# EAGLE schematic perfect-cell-v0.1 (EAGLE 7.3.0)

## Sheet 1 of 3
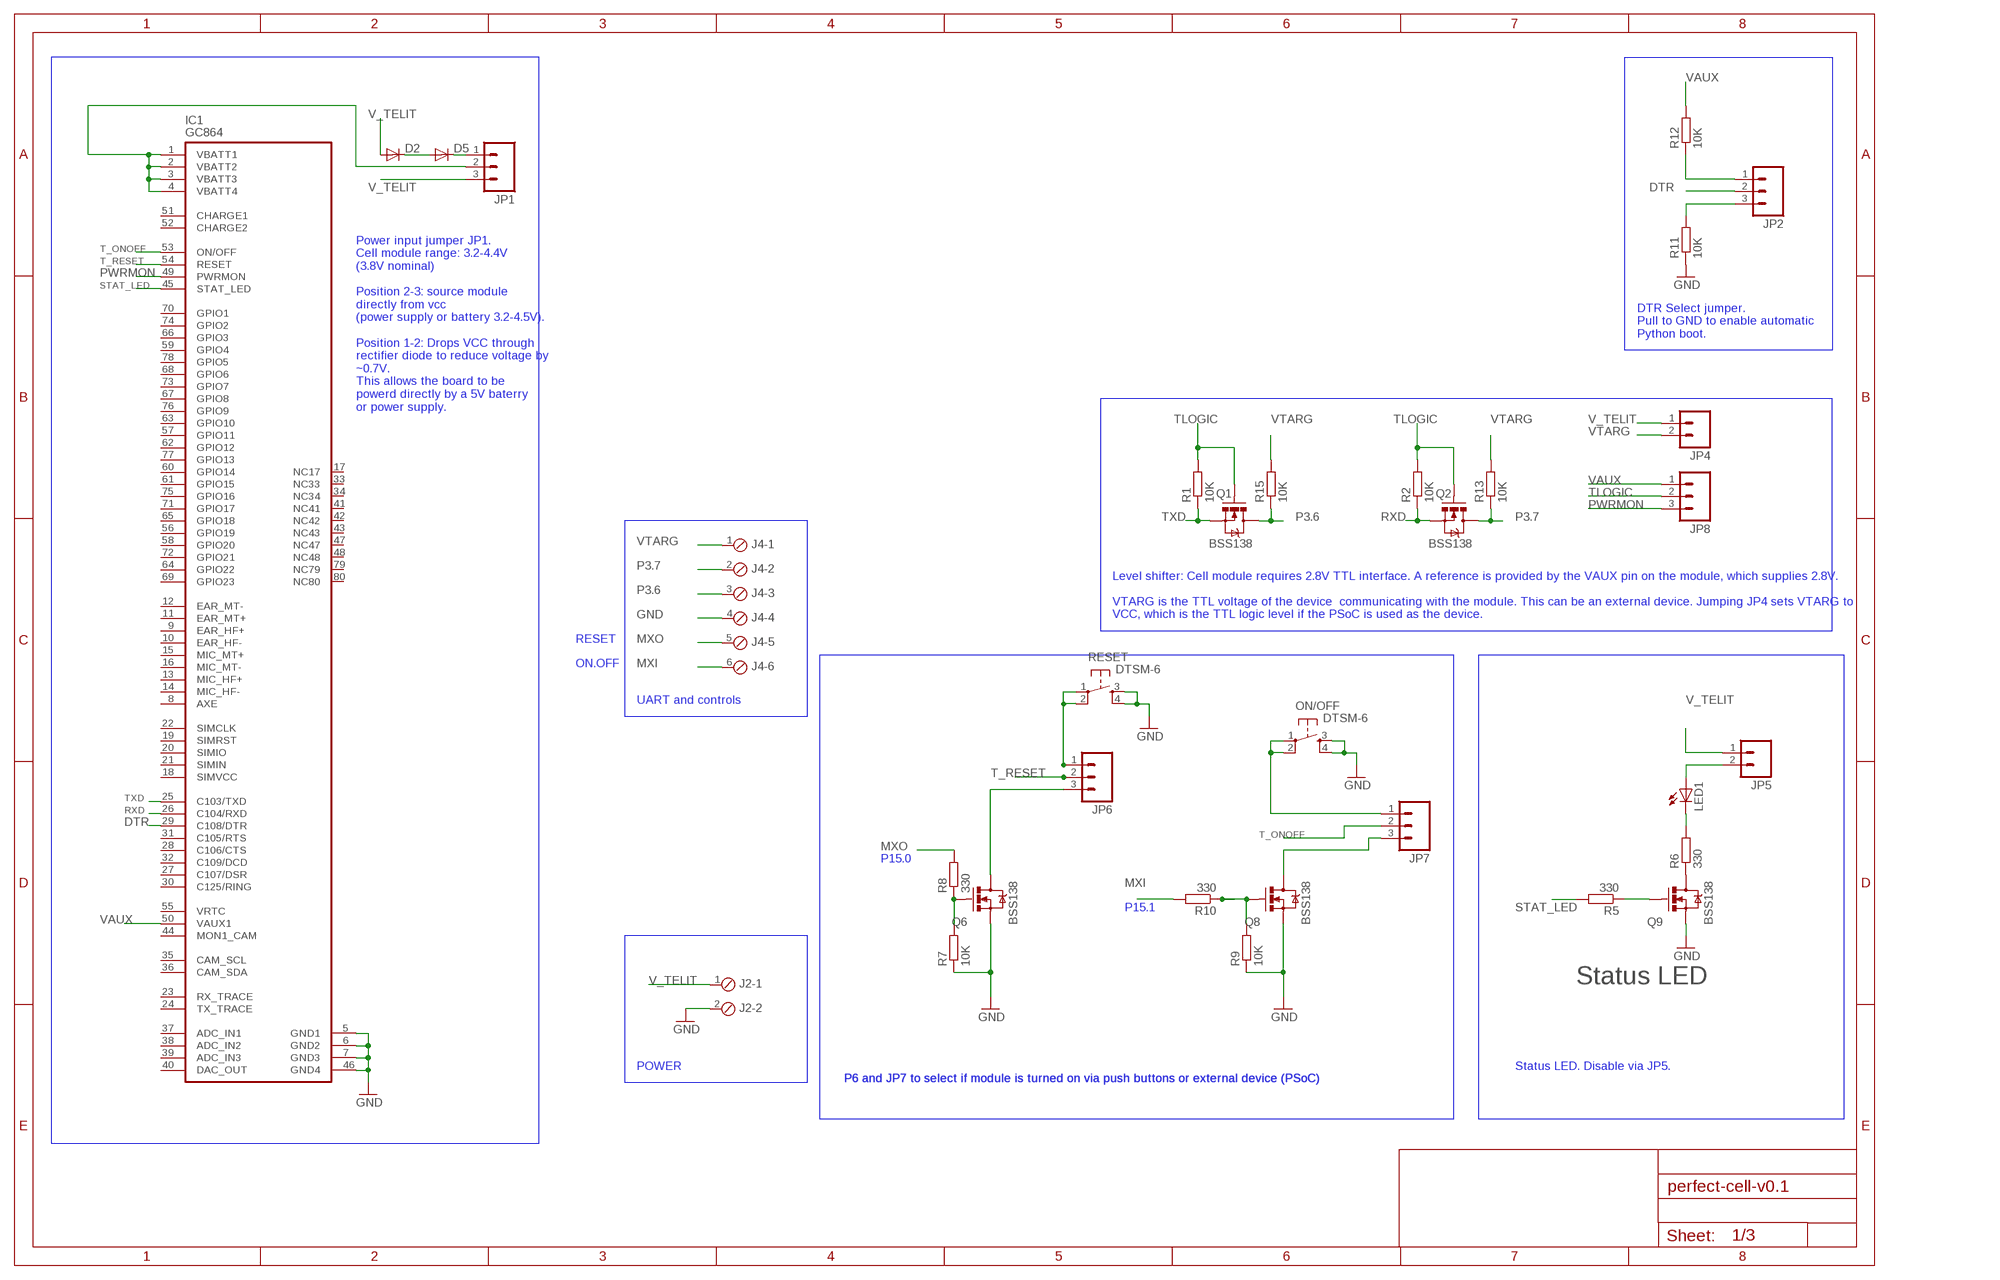
[diagram p0: schematic, sheet 1]

### Parts
D2  DIODESMA  [SMA-DIODE]
D5  DIODESMA  [SMA-DIODE]
IC1  GC864  [GC864]
J2  MPT2  [2POL254]
J4  MPT6  [6POL254]
JP1  M03LOCK  [1X03_LOCK]
JP2  M03LOCK  [1X03_LOCK]
JP4  M02LOCK  [1X02_LOCK]
JP5  M02LOCK  [1X02_LOCK]
JP6  M03LOCK  [1X03_LOCK]
JP7  M03LOCK  [1X03_LOCK]
JP8  M03LOCK  [1X03_LOCK]
LED1  LEDSML0805  [SML0805]
ON/OFF  DTSM-6  [DTSM-6]
Q1  BSS138  MOSFET-NCHANNELSMD  [SOT23-3]
Q2  BSS138  MOSFET-NCHANNELSMD  [SOT23-3]
Q6  BSS138  MOSFET-NCHANNELSMD  [SOT23-3]
Q8  BSS138  MOSFET-NCHANNELSMD  [SOT23-3]
Q9  BSS138  MOSFET-NCHANNELSMD  [SOT23-3]
R1  10K  R-EU_R0805  [R0805]
R2  10K  R-EU_R0805  [R0805]
R5  330  R-EU_R0805  [R0805]
R6  330  R-EU_R0805  [R0805]
R7  10K  R-EU_R0805  [R0805]
R8  330  R-EU_R0805  [R0805]
R9  10K  R-EU_R0805  [R0805]
R10  330  R-EU_R0805  [R0805]
R11  10K  R-EU_R0805  [R0805]
R12  10K  R-EU_R0805  [R0805]
R13  10K  R-EU_R0805  [R0805]
R15  10K  R-EU_R0805  [R0805]
RESET  DTSM-6  [DTSM-6]

### Nets
DTR: IC1.29(C108/DTR) JP2.2
GND: IC1.5(GND1) IC1.6(GND2) IC1.7(GND3) IC1.46(GND4) J2.2 J4.4 ON/OFF.3 ON/OFF.4 Q6.2(S) Q8.2(S) Q9.2(S) R7.1 R9.1 R11.1 RESET.3 RESET.4 ; also sheet 2,3
MXI: J4.6 R10.2 ; also sheet 3
MXO: J4.5 R8.2 ; also sheet 3
N$1: Q6.1(G) R7.2 R8.1
N$2: IC1.1(VBATT1) IC1.2(VBATT2) IC1.3(VBATT3) IC1.4(VBATT4) JP1.2
N$3: D2.C D5.A
N$4: Q9.3(D) R6.1
N$7: JP5.2 LED1.A
N$8: LED1.C R6.2
N$9: Q8.1(G) R9.2 R10.1
N$10: Q9.1(G) R5.1
N$11: JP2.1 R12.1
N$13: JP2.3 R11.2
N$14: D5.C JP1.1
N$15: JP7.3 Q8.3(D)
N$17: JP6.3 Q6.3(D)
N$21: JP7.1 ON/OFF.1 ON/OFF.2
N$39: JP6.1 RESET.1 RESET.2
P3.6: J4.3 Q1.3(D) R15.1 ; also sheet 3
P3.7: J4.2 Q2.3(D) R13.1 ; also sheet 3
PWRMON: IC1.49(PWRMON) JP8.3
RXD: IC1.26(C104/RXD) Q2.2(S) R2.1
STAT_LED: IC1.45(STAT_LED) R5.2
T_ONOFF: IC1.53(ON/OFF) JP7.2
T_RESET: IC1.54(RESET) JP6.2
TLOGIC: JP8.2 Q1.1(G) Q2.1(G) R1.2 R2.2
TXD: IC1.25(C103/TXD) Q1.2(S) R1.1
V_TELIT: D2.A J2.1 JP1.3 JP4.1 JP5.1 ; also sheet 2
VAUX: IC1.50(VAUX1) JP8.1 R12.2
VTARG: J4.1 JP4.2 R13.2 R15.2
Unconnected: IC1.8(AXE) IC1.9(EAR_HF+) IC1.10(EAR_HF-) IC1.11(EAR_MT+) IC1.12(EAR_MT-) IC1.13(MIC_HF+) IC1.14(MIC_HF-) IC1.15(MIC_MT+) IC1.16(MIC_MT-) IC1.17(NC17) IC1.18(SIMVCC) IC1.19(SIMRST) IC1.20(SIMIO) IC1.21(SIMIN) IC1.22(SIMCLK) IC1.23(RX_TRACE) IC1.24(TX_TRACE) IC1.27(C107/DSR) IC1.28(C106/CTS) IC1.30(C125/RING) IC1.31(C105/RTS) IC1.32(C109/DCD) IC1.33(NC33) IC1.34(NC34) IC1.35(CAM_SCL) IC1.36(CAM_SDA) IC1.37(ADC_IN1) IC1.38(ADC_IN2) IC1.39(ADC_IN3) IC1.40(DAC_OUT) IC1.41(NC41) IC1.42(NC42) IC1.43(NC43) IC1.44(MON1_CAM) IC1.47(NC47) IC1.48(NC48) IC1.55(VRTC) IC1.56(GPIO19) IC1.57(GPIO11) IC1.58(GPIO20) IC1.59(GPIO4) IC1.60(GPIO14) IC1.61(GPIO15) IC1.62(GPIO12) IC1.63(GPIO10) IC1.64(GPIO22) IC1.65(GPIO18) IC1.66(GPIO3) IC1.67(GPIO8) IC1.68(GPIO6) IC1.69(GPIO23) IC1.70(GPIO1) IC1.71(GPIO17) IC1.72(GPIO21) IC1.73(GPIO7) IC1.74(GPIO2) IC1.75(GPIO16) IC1.76(GPIO9) IC1.77(GPIO13) IC1.78(GPIO5) IC1.79(NC79) IC1.80(NC80)

### Notes on the sheet
- DTR Select jumper.
  Pull to GND to enable automatic 
  Python boot.
- Power input jumper JP1. 
  Cell module range: 3.2-4.4V 
  (3.8V nominal)
  
  Position 2-3: source module
  directly from vcc
  (power supply or battery 3.2-4.5V).
  
  Position 1-2: Drops VCC through 
  rectifier diode to reduce voltage by 
  ~0.7V. 
  This allows the board to be
  powerd directly by a 5V baterry
  or power supply.
- Level shifter: Cell module requires 2.8V TTL interface. A reference is provided by the VAUX pin on the module, which supplies 2.8V.
  
  VTARG is the TTL voltage of the device  communicating with the module. This can be an external device. Jumping JP4 sets VTARG to 
  VCC, which is the TTL logic level if the PSoC is used as the device.
- RESET
- ON.OFF
- UART and controls
- P15.0
- P15.1
- Status LED
- POWER | Status LED. Disable via JP5.
- P6 and JP7 to select if module is turned on via push buttons or external device (PSoC) | P6 and JP7 to select if module is turned on via push buttons or external device (PSoC)

## Sheet 2 of 3
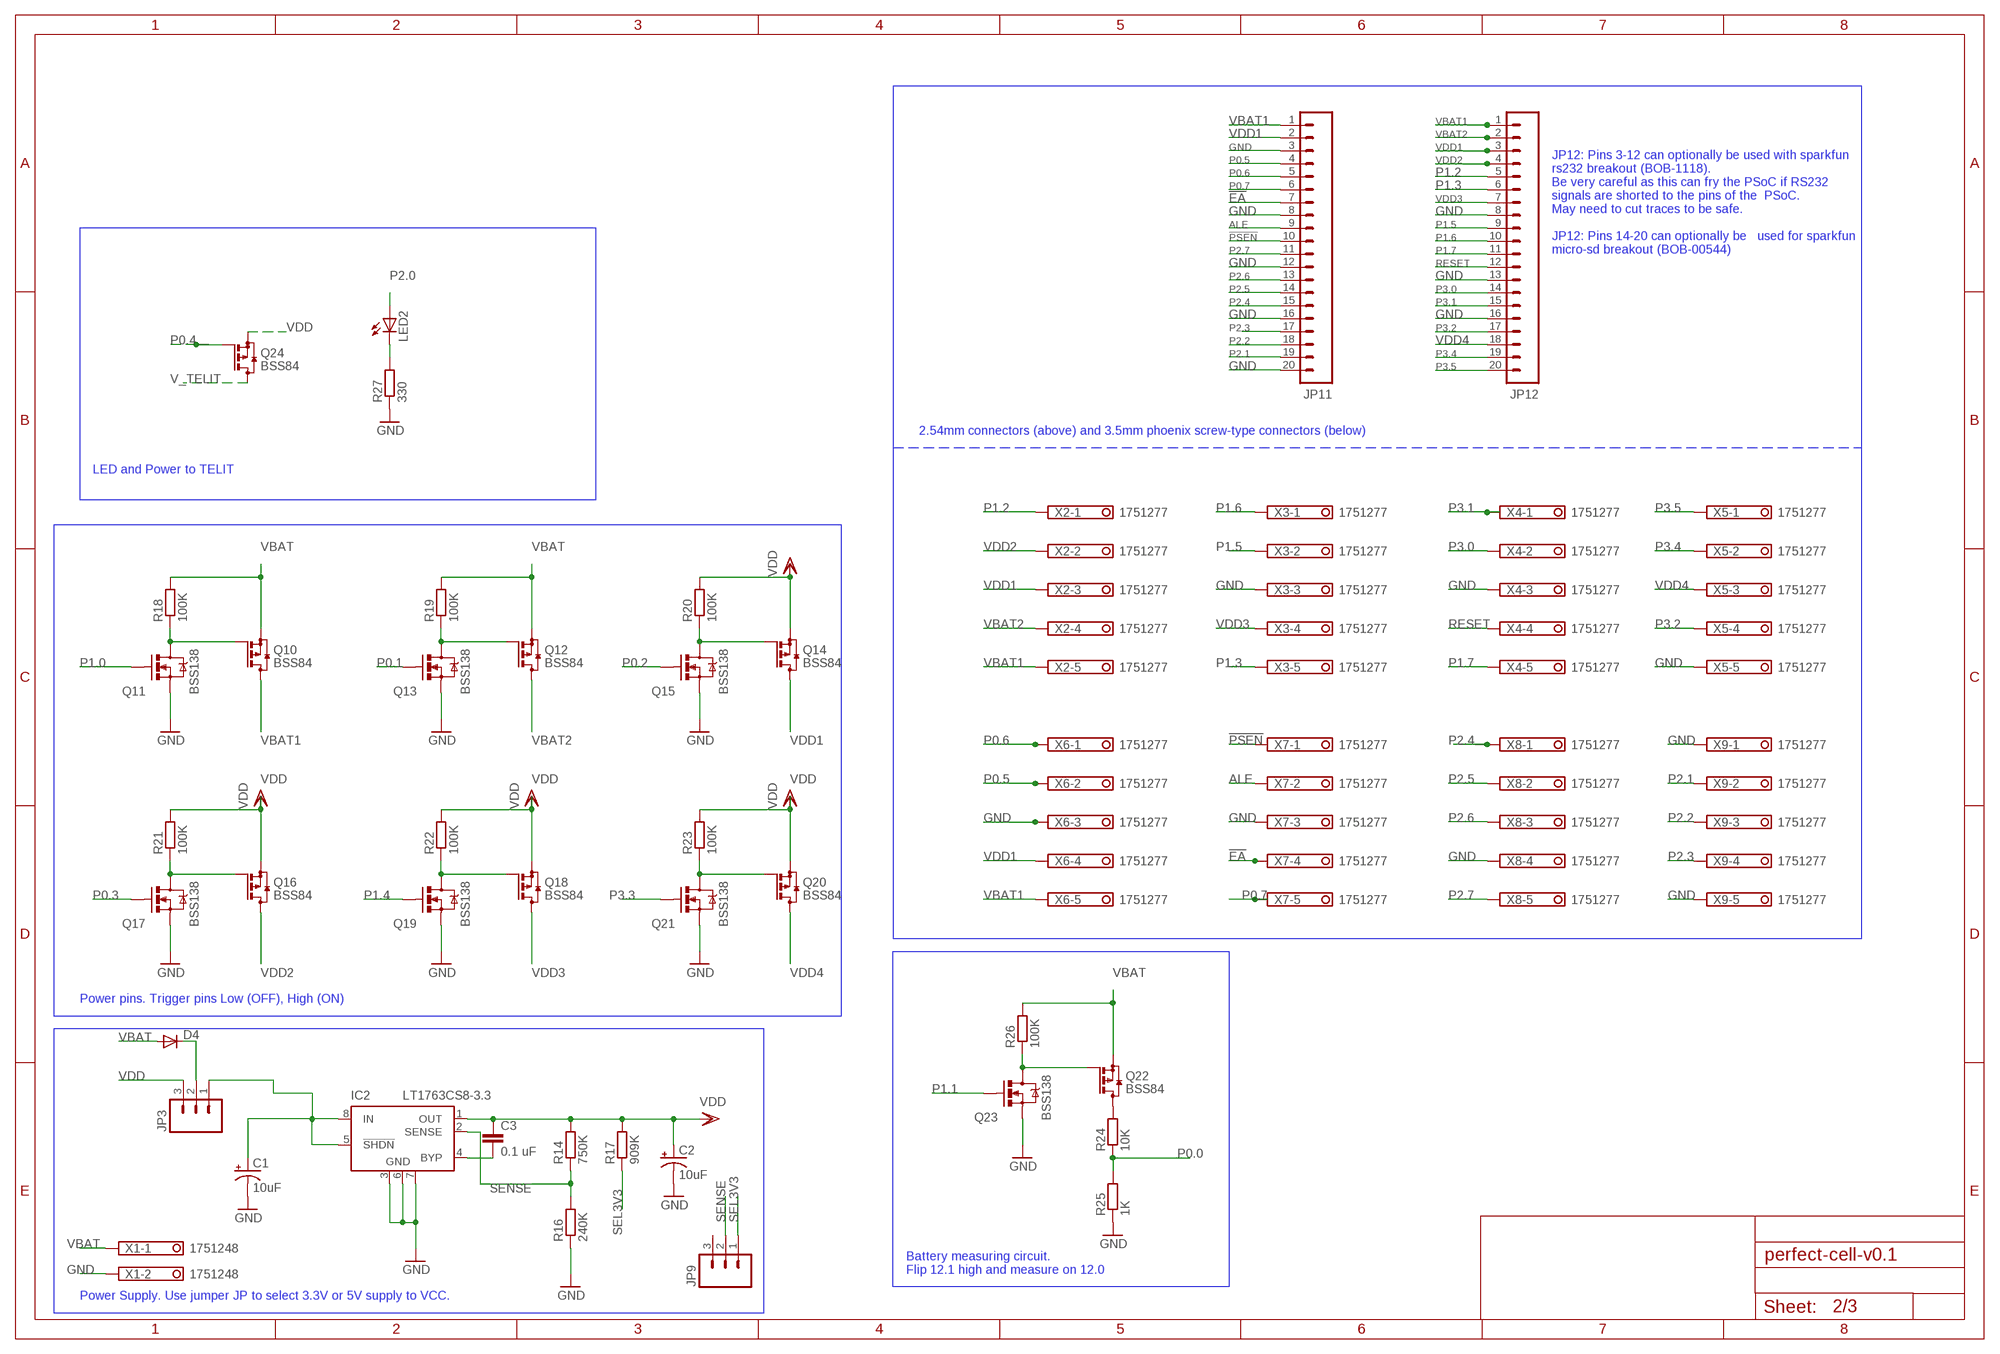
[diagram p1: schematic, sheet 2]

### Parts
C1  10uF  10UF-16V-10%(TANT)  [EIA3216]
C2  10uF  10UF-16V-10%(TANT)  [EIA3216]
C3  0.1 uF  CAP0402-CAP  [0402-CAP]
D4  DIODESMA  [SMA-DIODE]
IC2  LT1763CS8-3.3  [SOIC8]
JP3  M03LOCK  [1X03_LOCK]
JP9  M03LOCK  [1X03_LOCK]
JP11  M20  [1X20]
JP12  M20  [1X20]
LED2  LEDSML0805  [SML0805]
Q10  BSS84  [SOT23]
Q11  BSS138  MOSFET-NCHANNELSMD  [SOT23-3]
Q12  BSS84  [SOT23]
Q13  BSS138  MOSFET-NCHANNELSMD  [SOT23-3]
Q14  BSS84  [SOT23]
Q15  BSS138  MOSFET-NCHANNELSMD  [SOT23-3]
Q16  BSS84  [SOT23]
Q17  BSS138  MOSFET-NCHANNELSMD  [SOT23-3]
Q18  BSS84  [SOT23]
Q19  BSS138  MOSFET-NCHANNELSMD  [SOT23-3]
Q20  BSS84  [SOT23]
Q21  BSS138  MOSFET-NCHANNELSMD  [SOT23-3]
Q22  BSS84  [SOT23]
Q23  BSS138  MOSFET-NCHANNELSMD  [SOT23-3]
Q24  BSS84  [SOT23]
R14  750K  R-EU_R0805  [R0805]
R16  240K  R-EU_R0805  [R0805]
R17  909K  R-EU_R0805  [R0805]
R18  100K  R-EU_R0805  [R0805]
R19  100K  R-EU_R0805  [R0805]
R20  100K  R-EU_R0805  [R0805]
R21  100K  R-EU_R0805  [R0805]
R22  100K  R-EU_R0805  [R0805]
R23  100K  R-EU_R0805  [R0805]
R24  10K  R-EU_R0805  [R0805]
R25  1K  R-EU_R0805  [R0805]
R26  100K  R-EU_R0805  [R0805]
R27  330  R-EU_R0805  [R0805]
X1  1751248  [1751248]
X2  1751277  [1751277]
X3  1751277  [1751277]
X4  1751277  [1751277]
X5  1751277  [1751277]
X6  1751277  [1751277]
X7  1751277  [1751277]
X8  1751277  [1751277]
X9  1751277  [1751277]

### Nets
!EA: JP11.7 X7.4 ; also sheet 3
!PSEN: JP11.10 X7.1 ; also sheet 3
ALE: JP11.9 X7.2 ; also sheet 3
GND: C1.C(-) C2.C(-) IC2.3(GND) IC2.6(GND) IC2.7(GND) JP11.3 JP11.8 JP11.12 JP11.16 JP11.20 JP12.8 JP12.13 JP12.16 Q11.2(S) Q13.2(S) Q15.2(S) Q17.2(S) Q19.2(S) Q21.2(S) Q23.2(S) R16.1 R25.1 R27.1 X1.2 X3.3 X4.3 X5.5 X6.3 X7.3 X8.4 X9.1 X9.5 ; also sheet 1,3
N$5: D4.C JP3.2
N$16: Q10.1(G) Q11.3(D) R18.1
N$18: C1.A(+) IC2.5(!SHDN) IC2.8(IN) JP3.1
N$19: Q12.1(G) Q13.3(D) R19.1
N$20: C3.2 IC2.4(BYP)
N$22: Q14.1(G) Q15.3(D) R20.1
N$23: Q16.1(G) Q17.3(D) R21.1
N$24: Q18.1(G) Q19.3(D) R22.1
N$25: Q20.1(G) Q21.3(D) R23.1
N$26: Q22.1(G) Q23.3(D) R26.1
N$27: Q22.3(D) R24.2
N$29: LED2.C R27.2
P0.0: R24.1 R25.2 ; also sheet 3
P0.1: Q13.1(G) ; also sheet 3
P0.2: Q15.1(G) ; also sheet 3
P0.3: Q17.1(G) ; also sheet 3
P0.4: Q24.1(G) ; also sheet 3
P0.5: JP11.4 X6.2 ; also sheet 3
P0.6: JP11.5 X6.1 ; also sheet 3
P0.7: JP11.6 X7.5 ; also sheet 3
P1.0: Q11.1(G) ; also sheet 3
P1.1: Q23.1(G) ; also sheet 3
P1.2: JP12.5 X2.1 ; also sheet 3
P1.3: JP12.6 X3.5 ; also sheet 3
P1.4: Q19.1(G) ; also sheet 3
P1.5: JP12.9 X3.2 ; also sheet 3
P1.6: JP12.10 X3.1 ; also sheet 3
P1.7: JP12.11 X4.5 ; also sheet 3
P2.0: LED2.A ; also sheet 3
P2.1: JP11.19 X9.2 ; also sheet 3
P2.2: JP11.18 X9.3 ; also sheet 3
P2.3: JP11.17 X9.4 ; also sheet 3
P2.4: JP11.15 X8.1 ; also sheet 3
P2.5: JP11.14 X8.2 ; also sheet 3
P2.6: JP11.13 X8.3 ; also sheet 3
P2.7: JP11.11 X8.5 ; also sheet 3
P3.0: JP12.14 X4.2 ; also sheet 3
P3.1: JP12.15 X4.1 ; also sheet 3
P3.2: JP12.17 X5.4 ; also sheet 3
P3.3: Q21.1(G) ; also sheet 3
P3.4: JP12.19 X5.2 ; also sheet 3
P3.5: JP12.20 X5.1 ; also sheet 3
RESET: JP12.12 X4.4 ; also sheet 3
SEL3V3: JP9.1 R17.1
SENSE: IC2.2(SENSE) JP9.2 R14.1 R16.2
V_TELIT: Q24.3(D) ; also sheet 1
VBAT: D4.A Q10.2(S) Q12.2(S) Q22.2(S) R18.2 R19.2 R26.2 X1.1
VBAT1: JP11.1 JP12.1 Q10.3(D) X2.5 X6.5
VBAT2: JP12.2 Q12.3(D) X2.4
VDD: C2.A(+) C3.1 IC2.1(OUT) JP3.3 Q14.2(S) Q16.2(S) Q18.2(S) Q20.2(S) Q24.2(S) R14.2 R17.2 R20.2 R21.2 R22.2 R23.2 ; also sheet 3
VDD1: JP11.2 JP12.3 Q14.3(D) X2.3 X6.4
VDD2: JP12.4 Q16.3(D) X2.2
VDD3: JP12.7 Q18.3(D) X3.4
VDD4: JP12.18 Q20.3(D) X5.3
Unconnected: JP9.3

### Notes on the sheet
- JP12: Pins 3-12 can optionally be used with sparkfun 
  rs232 breakout (BOB-1118). 
  Be very careful as this can fry the PSoC if RS232 
  signals are shorted to the pins of the  PSoC. 
  May need to cut traces to be safe.
  
  JP12: Pins 14-20 can optionally be   used for sparkfun 
  micro-sd breakout (BOB-00544)
- 2.54mm connectors (above) and 3.5mm phoenix screw-type connectors (below)
- LED and Power to TELIT
- Power pins. Trigger pins Low (OFF), High (ON)
- Battery measuring circuit. 
  Flip 12.1 high and measure on 12.0
- Power Supply. Use jumper JP to select 3.3V or 5V supply to VCC.

## Sheet 3 of 3
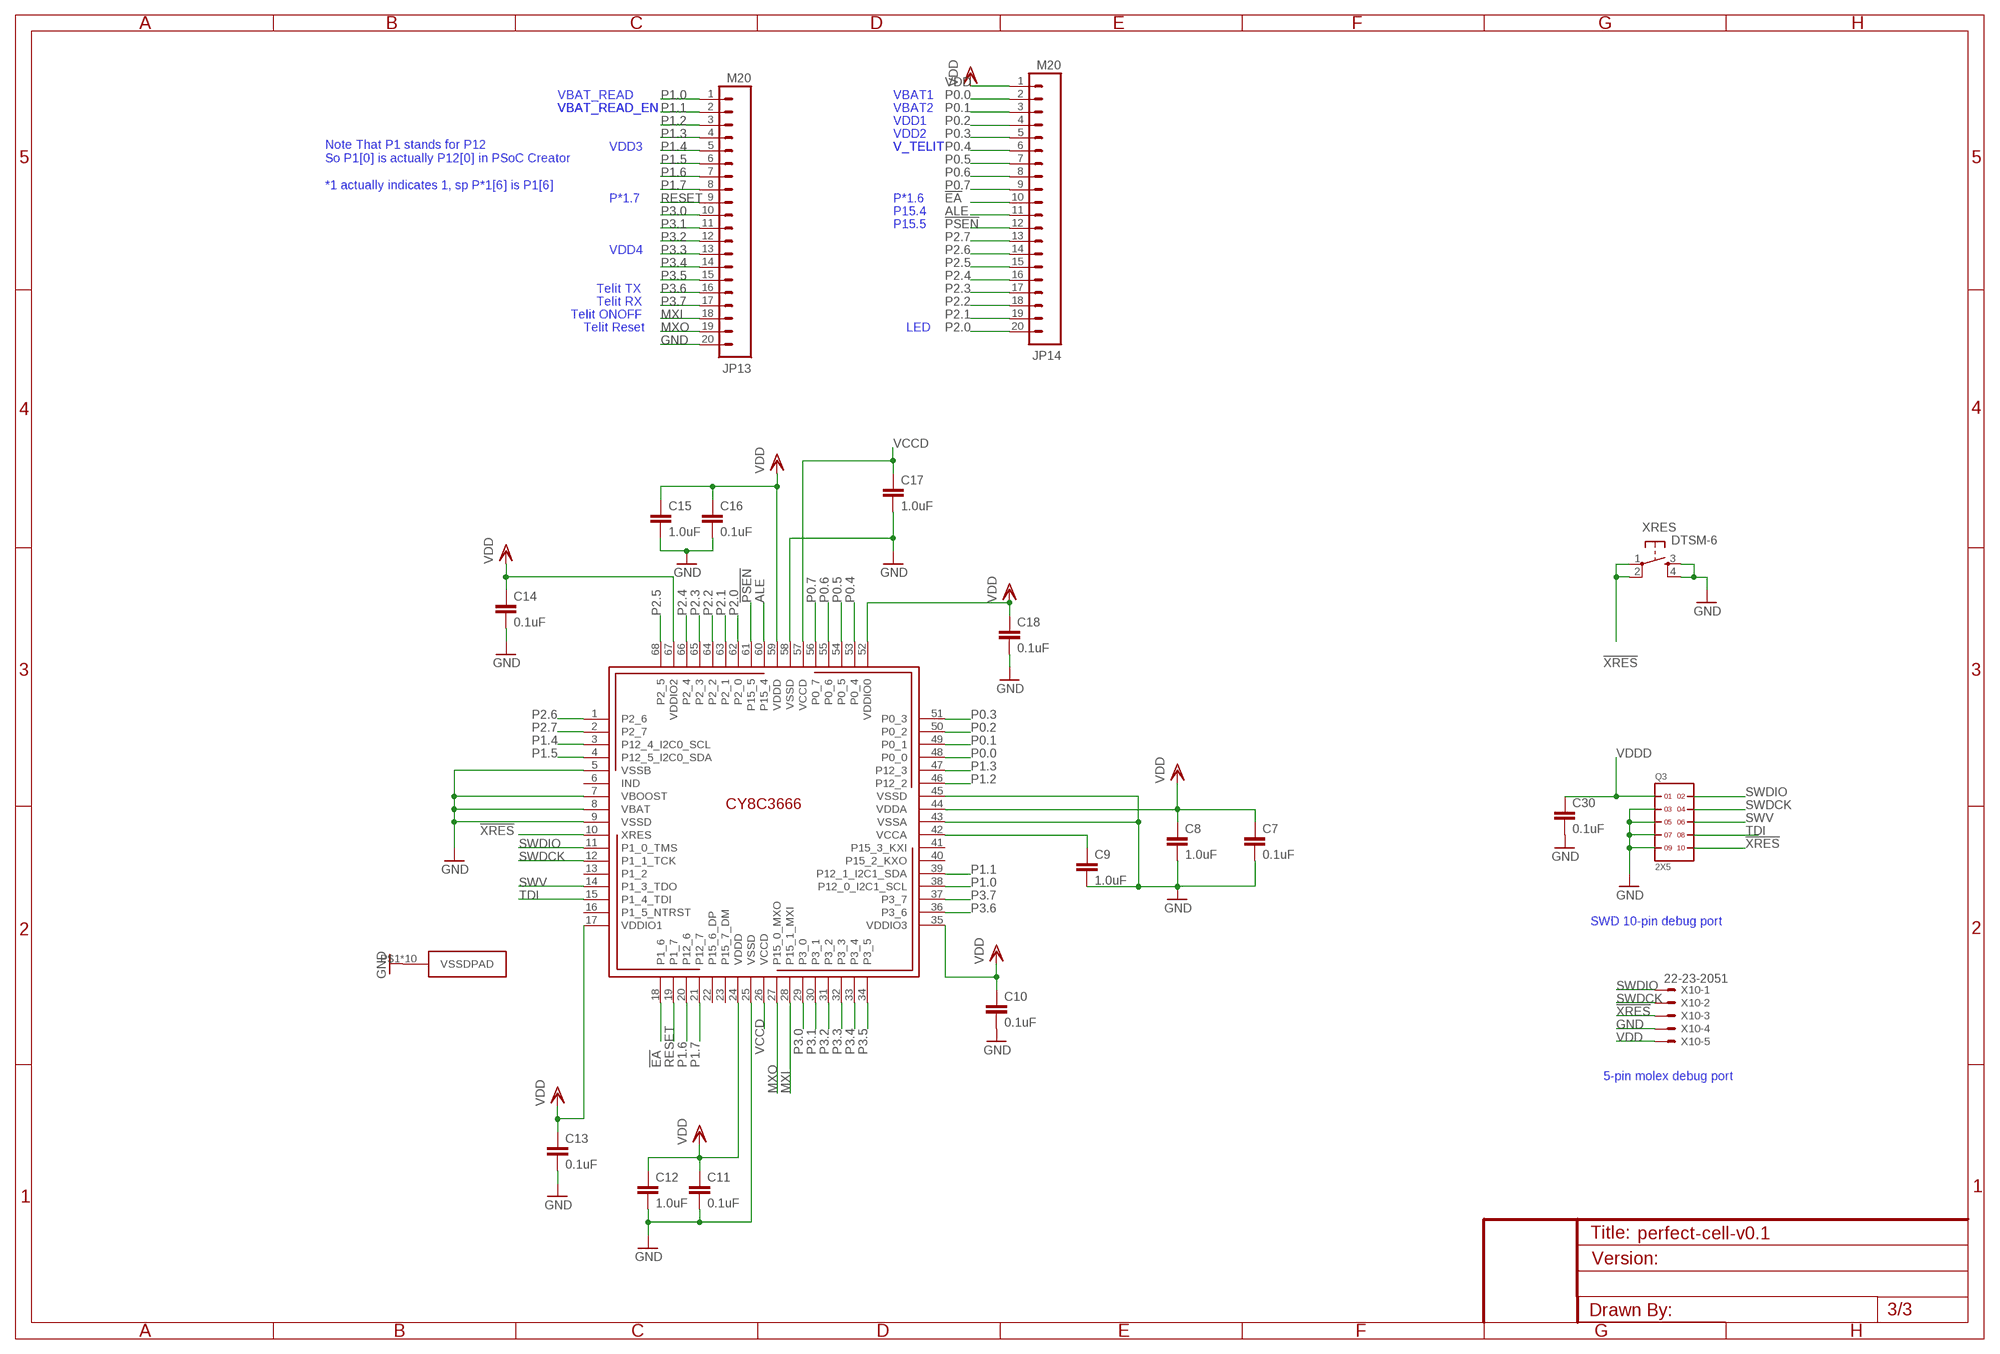
[diagram p2: schematic, sheet 3]

### Parts
C7  0.1uF  CAP0402-CAP  [0402-CAP]
C8  1.0uF  CAP0402-CAP  [0402-CAP]
C9  1.0uF  CAP0402-CAP  [0402-CAP]
C10  0.1uF  CAP0402-CAP  [0402-CAP]
C11  0.1uF  CAP0402-CAP  [0402-CAP]
C12  1.0uF  CAP0402-CAP  [0402-CAP]
C13  0.1uF  CAP0402-CAP  [0402-CAP]
C14  0.1uF  CAP0402-CAP  [0402-CAP]
C15  1.0uF  CAP0402-CAP  [0402-CAP]
C16  0.1uF  CAP0402-CAP  [0402-CAP]
C17  1.0uF  CAP0402-CAP  [0402-CAP]
C18  0.1uF  CAP0402-CAP  [0402-CAP]
C30  0.1uF  CAP0402-CAP  [0402-CAP]
JP13  M20  [1X20]
JP14  M20  [1X20]
Q3  2X5  [FTSH-105-01-XXX-DV-K]
U$1  CY8C3X66LTI  [QFN-68]
X10  22-23-2051  [22-23-2051]
XRES  DTSM-6  [DTSM-6]

### Nets
!EA: JP14.10 U$1.18(P1_6) ; also sheet 2
!PSEN: JP14.12 U$1.61(P15_5) ; also sheet 2
!XRES: Q3.10 U$1.10(XRES) X10.3 XRES.1 XRES.2
ALE: JP14.11 U$1.60(P15_4) ; also sheet 2
GND: C7.2 C8.2 C9.2 C10.2 C11.2 C12.2 C13.2 C14.2 C15.2 C16.2 C17.2 C18.2 C30.2 JP13.20 Q3.3 Q3.5 Q3.7 Q3.9 U$1.5(VSSB) U$1.7(VBOOST) U$1.8(VBAT) U$1.9(VSSD) U$1.25(VSSD) U$1.43(VSSA) U$1.45(VSSD) U$1.58(VSSD) U$1.P$1(VSSDPAD) U$1.P$2(VSSDPAD) U$1.P$3(VSSDPAD) U$1.P$4(VSSDPAD) U$1.P$5(VSSDPAD) U$1.P$6(VSSDPAD) U$1.P$7(VSSDPAD) U$1.P$8(VSSDPAD) U$1.P$9(VSSDPAD) U$1.PAD(VSSDPAD) X10.4 XRES.3 XRES.4 ; also sheet 1,2
MXI: JP13.18 U$1.28(P15_1_MXI) ; also sheet 1
MXO: JP13.19 U$1.27(P15_0_MXO) ; also sheet 1
N$35: C9.1 U$1.42(VCCA)
P0.0: JP14.2 U$1.48(P0_0) ; also sheet 2
P0.1: JP14.3 U$1.49(P0_1) ; also sheet 2
P0.2: JP14.4 U$1.50(P0_2) ; also sheet 2
P0.3: JP14.5 U$1.51(P0_3) ; also sheet 2
P0.4: JP14.6 U$1.53(P0_4) ; also sheet 2
P0.5: JP14.7 U$1.54(P0_5) ; also sheet 2
P0.6: JP14.8 U$1.55(P0_6) ; also sheet 2
P0.7: JP14.9 U$1.56(P0_7) ; also sheet 2
P1.0: JP13.1 U$1.38(P12_0_I2C1_SCL) ; also sheet 2
P1.1: JP13.2 U$1.39(P12_1_I2C1_SDA) ; also sheet 2
P1.2: JP13.3 U$1.46(P12_2) ; also sheet 2
P1.3: JP13.4 U$1.47(P12_3) ; also sheet 2
P1.4: JP13.5 U$1.3(P12_4_I2C0_SCL) ; also sheet 2
P1.5: JP13.6 U$1.4(P12_5_I2C0_SDA) ; also sheet 2
P1.6: JP13.7 U$1.20(P12_6) ; also sheet 2
P1.7: JP13.8 U$1.21(P12_7) ; also sheet 2
P2.0: JP14.20 U$1.62(P2_0) ; also sheet 2
P2.1: JP14.19 U$1.63(P2_1) ; also sheet 2
P2.2: JP14.18 U$1.64(P2_2) ; also sheet 2
P2.3: JP14.17 U$1.65(P2_3) ; also sheet 2
P2.4: JP14.16 U$1.66(P2_4) ; also sheet 2
P2.5: JP14.15 U$1.68(P2_5) ; also sheet 2
P2.6: JP14.14 U$1.1(P2_6) ; also sheet 2
P2.7: JP14.13 U$1.2(P2_7) ; also sheet 2
P3.0: JP13.10 U$1.29(P3_0) ; also sheet 2
P3.1: JP13.11 U$1.30(P3_1) ; also sheet 2
P3.2: JP13.12 U$1.31(P3_2) ; also sheet 2
P3.3: JP13.13 U$1.32(P3_3) ; also sheet 2
P3.4: JP13.14 U$1.33(P3_4) ; also sheet 2
P3.5: JP13.15 U$1.34(P3_5) ; also sheet 2
P3.6: JP13.16 U$1.36(P3_6) ; also sheet 1
P3.7: JP13.17 U$1.37(P3_7) ; also sheet 1
RESET: JP13.9 U$1.19(P1_7) ; also sheet 2
SWDCK: Q3.4 U$1.12(P1_1_TCK) X10.2
SWDIO: Q3.2 U$1.11(P1_0_TMS) X10.1
SWV: Q3.6 U$1.14(P1_3_TDO)
TDI: Q3.8 U$1.15(P1_4_TDI)
VCCD: C17.1 U$1.26(VCCD) U$1.57(VCCD)
VDD: C7.1 C8.1 C10.1 C11.1 C12.1 C13.1 C14.1 C15.1 C16.1 C18.1 JP14.1 U$1.17(VDDIO1) U$1.24(VDDD) U$1.35(VDDIO3) U$1.44(VDDA) U$1.52(VDDIO0) U$1.59(VDDD) U$1.67(VDDIO2) X10.5 ; also sheet 2
VDDD: C30.1 Q3.1
Unconnected: U$1.6(IND) U$1.13(P1_2) U$1.16(P1_5_NTRST) U$1.22(P15_6_DP) U$1.23(P15_7_DM) U$1.40(P15_2_KXO) U$1.41(P15_3_KXI)

### Notes on the sheet
- VBAT_READ | VBAT1
- VBAT_READ_EN | VBAT_READ_EN | VBAT2
- VDD1
- VDD2
- VDD3 | V_TELIT | V_TELIT
- Note That P1 stands for P12
  So P1[0] is actually P12[0] in PSoC Creator
  
  *1 actually indicates 1, sp P*1[6] is P1[6]
- P*1.7 | P*1.6
- P15.4
- P15.5
- VDD4
- Telit TX
- Telit RX
- Telit ONOFF
- Telit Reset | LED
- SWD 10-pin debug port
- 5-pin molex debug port

## Power pins joined to a net without a drawn wire
CHARGE1: IC1.51(CHARGE1)
CHARGE2: IC1.52(CHARGE2)

## Library data of the parts
C1 C2 = SparkFun-Capacitors:10UF-16V-10%(TANT): CAP-00811 1206/EIA-3216 Tantalum capacitor; PROD_ID: CAP-00811
C3 = SparkFun:CAP: Capacitor Standard 0603 ceramic capacitor, and 0.1" leaded capacitor.
C7 C10 C11 C13 C14 C16 C18 C30 = SparkFun:CAP: Capacitor Standard 0603 ceramic capacitor, and 0.1" leaded capacitor.; PN: LMK105BJ104KV-F
C8 C9 C12 C15 C17 = SparkFun:CAP: Capacitor Standard 0603 ceramic capacitor, and 0.1" leaded capacitor.; PN: JMK105BJ105KV-F
D2 D4 D5 = SparkFun:DIODE: Diode These are standard reverse protection diodes and small signal diodes. SMA package can handle up to about 1A. SOD-323 can handle about 200mA. What the SOD-323 package when ordering, there are some mfgs out there that are 5-pin packages.
IC1 = telit-modules:GC864: Telit GC864
IC2 = linear-technology:LT1763CS8: 500mA, Low Noise, LDO Micropower Regulators Source: http://cds.linear.com/docs/Datasheet/1763ff.pdf; MPN: LT1763CS8-3.3; OC_FARNELL: 1273617; OC_NEWARK: 57M6055
J2 = con-phoenix-254:MPT2: PHOENIX CONNECTOR; OC_FARNELL: unknown; OC_NEWARK: unknown
J4 = con-phoenix-254:MPT6: PHOENIX CONNECTOR; OC_FARNELL: unknown; OC_NEWARK: unknown
JP1-JP3 JP6-JP9 = SparkFun-Connectors:M03: Header 3 Standard 3-pin 0.1" header. Use with straight break away headers (SKU : PRT-00116), right angle break away headers (PRT-00553), swiss pins (PRT-00743), machine pins (PRT-00117), and female headers (PRT-00115). Molex polarized connector foot print use with SKU : PRT-08232 with associated crimp pins and housings.
JP4 JP5 = SparkFun-Connectors:M02: Standard 2-pin 0.1" header. Use with - straight break away headers ( PRT-00116) - right angle break away headers (PRT-00553) - swiss pins (PRT-00743) - machine pins (PRT-00117) - female headers (PRT-00115) Molex polarized connector foot print use with: PRT-08233 with associated crimp pins and housings. 2.54_SCREWTERM for use with PRT-10571. 3.5mm Screw Terminal footprints for PRT-08084 5mm Screw Terminal footprints for use with PRT-08432
JP11 JP12 = SparkFun-Connectors:M20: 1x20 .1" header This is just like the LOCK variant in that the holes are staggared by 5 mil, but except for the last two holes. They are not altered from the "standard" footprint layout. This is used for a special purpose on the layout of our Graphic LCD Backpack. Make sure you want to use this device before selecting it for you project!
JP13 JP14 = SparkFun:M20
LED1 LED2 = led:LED: LED OSRAM: - CHIPLED LG R971, LG N971, LY N971, LG Q971, LY Q971, LO R971, LY R971 LH N974, LH R974 LS Q976, LO Q976, LY Q976 LO Q996 - Hyper CHIPLED LW Q18S LB Q993, LB Q99A, LB R99A - SideLED LS A670, LO A670, LY A670, LG A670, LP A670 LB A673, LV A673, LT A673, LW A673 LH A674 LY A675 LS A676, LA A676, LO A676, LY A676, LW A676 LS A679, LY A679, LG A679 - Hyper Micro SIDELED® LS Y876, LA Y876, LO Y876, LY Y876 LT Y87S - SmartLED LW L88C, LW L88S LB L89C, LB L89S, LG L890 LS L89K, LO L89K, LY L89K LS L896, LA L896, LO L896, LY L896 - TOPLED LS T670, LO T670, LY T670, LG T670, LP T670 LSG T670, LSP T670, LSY T670, LOP T670, LYG T670 LG T671, LOG T671, LSG T671 LB T673, LV T673, LT T673, LW T673 LH T674 LS T676, LA T676, LO T676, LY T676, LB T676, LH T676, LSB T676, LW T676 LB T67C, LV T67C, LT T67C, LS T67K, LO T67K, LY T67K, LW E67C LS E67B, LA E67B, LO E67B, LY E67B, LB E67C, LV E67C, LT E67C LW T67C LS T679, LY T679, LG T679 LS T770, LO T770, LY T770, LG T770, LP T770 LB T773, LV T773, LT T773, LW T773 LH T774 LS E675, LA E675, LY E675, LS T675 LS T776, LA T776, LO T776, LY T776, LB T776 LHGB T686 LT T68C, LB T68C - Hyper Mini TOPLED® LB M676 - Mini TOPLED Santana® LG M470 LS M47K, LO M47K, LY M47K Source: http://www.osram.convergy.de LUXEON: - LUMILED® LXK2-PW12-R00, LXK2-PW12-S00, LXK2-PW14-U00, LXK2-PW14-V00 LXK2-PM12-R00, LXK2-PM12-S00, LXK2-PM14-U00 LXK2-PE12-Q00, LXK2-PE12-R00, LXK2-PE12-S00, LXK2-PE14-T00, LXK2-PE14-U00 LXK2-PB12-K00, LXK2-PB12-L00, LXK2-PB12-M00, LXK2-PB14-N00, LXK2-PB14-P00, LXK2-PB14-Q00 LXK2-PR12-L00, LXK2-PR12-M00, LXK2-PR14-Q00, LXK2-PR14-R00 LXK2-PD12-Q00, LXK2-PD12-R00, LXK2-PD12-S00 LXK2-PH12-R00, LXK2-PH12-S00 LXK2-PL12-P00, LXK2-PL12-Q00, LXK2-PL12-R00 Source: www.luxeon.com KINGBRIGHT: KA-3528ASYC Source: www.kingbright.com
ON/OFF RESET XRES = switch-tact:DTSM-6
Q1 Q2 Q6 Q8 Q9 Q11 Q13 Q15 Q17 Q19 Q21 Q23 = SparkFun:MOSFET-NCHANNEL
Q3 = samtec:2X5
Q10 Q12 Q14 Q16 Q18 Q20 Q22 Q24 = transistor-small-signal:BSS84: P-CHANNEL MOS FET
R1 R2 R5-R27 = rcl:R-EU_: RESISTOR, European symbol
U$1 = PSoC3:CY8C3X66LTI; PN: CY8C5568LTI-114
X1 = con-phoenix-350:1751248: MKDS 1/ 2-3,5 Printklemme Nennstrom: 10 A Bemessungsspannung: 160 V Raster: 3,5 mm Polzahl: 2 Montageart: Löten Anschlussart: Schraubanschluss Anschlussrichtung vom Leiter zur Platine: 0° Source: http://eshop.phoenixcontact.com .. 1751248.pdf; OC_FARNELL: unknown; OC_NEWARK: unknown
X2-X9 = con-phoenix-350:1751277: MKDS 1/ 5-3,5 Printklemme Nennstrom: 10 A Bemessungsspannung: 160 V Raster: 3,5 mm Polzahl: 5 Montageart: Löten Anschlussart: Schraubanschluss Anschlussrichtung vom Leiter zur Platine: 0° Source: http://eshop.phoenixcontact.com .. 1751277.pdf; OC_FARNELL: unknown; OC_NEWARK: unknown
X10 = con-molex:22-23-2051: .100" (2.54mm) Center Header - 5 Pin; MF: MOLEX; MPN: 22-23-2051; OC_FARNELL: 1462952; OC_NEWARK: 38C9178